# EAGLE design sensorBoard (EAGLE 7.6.0)
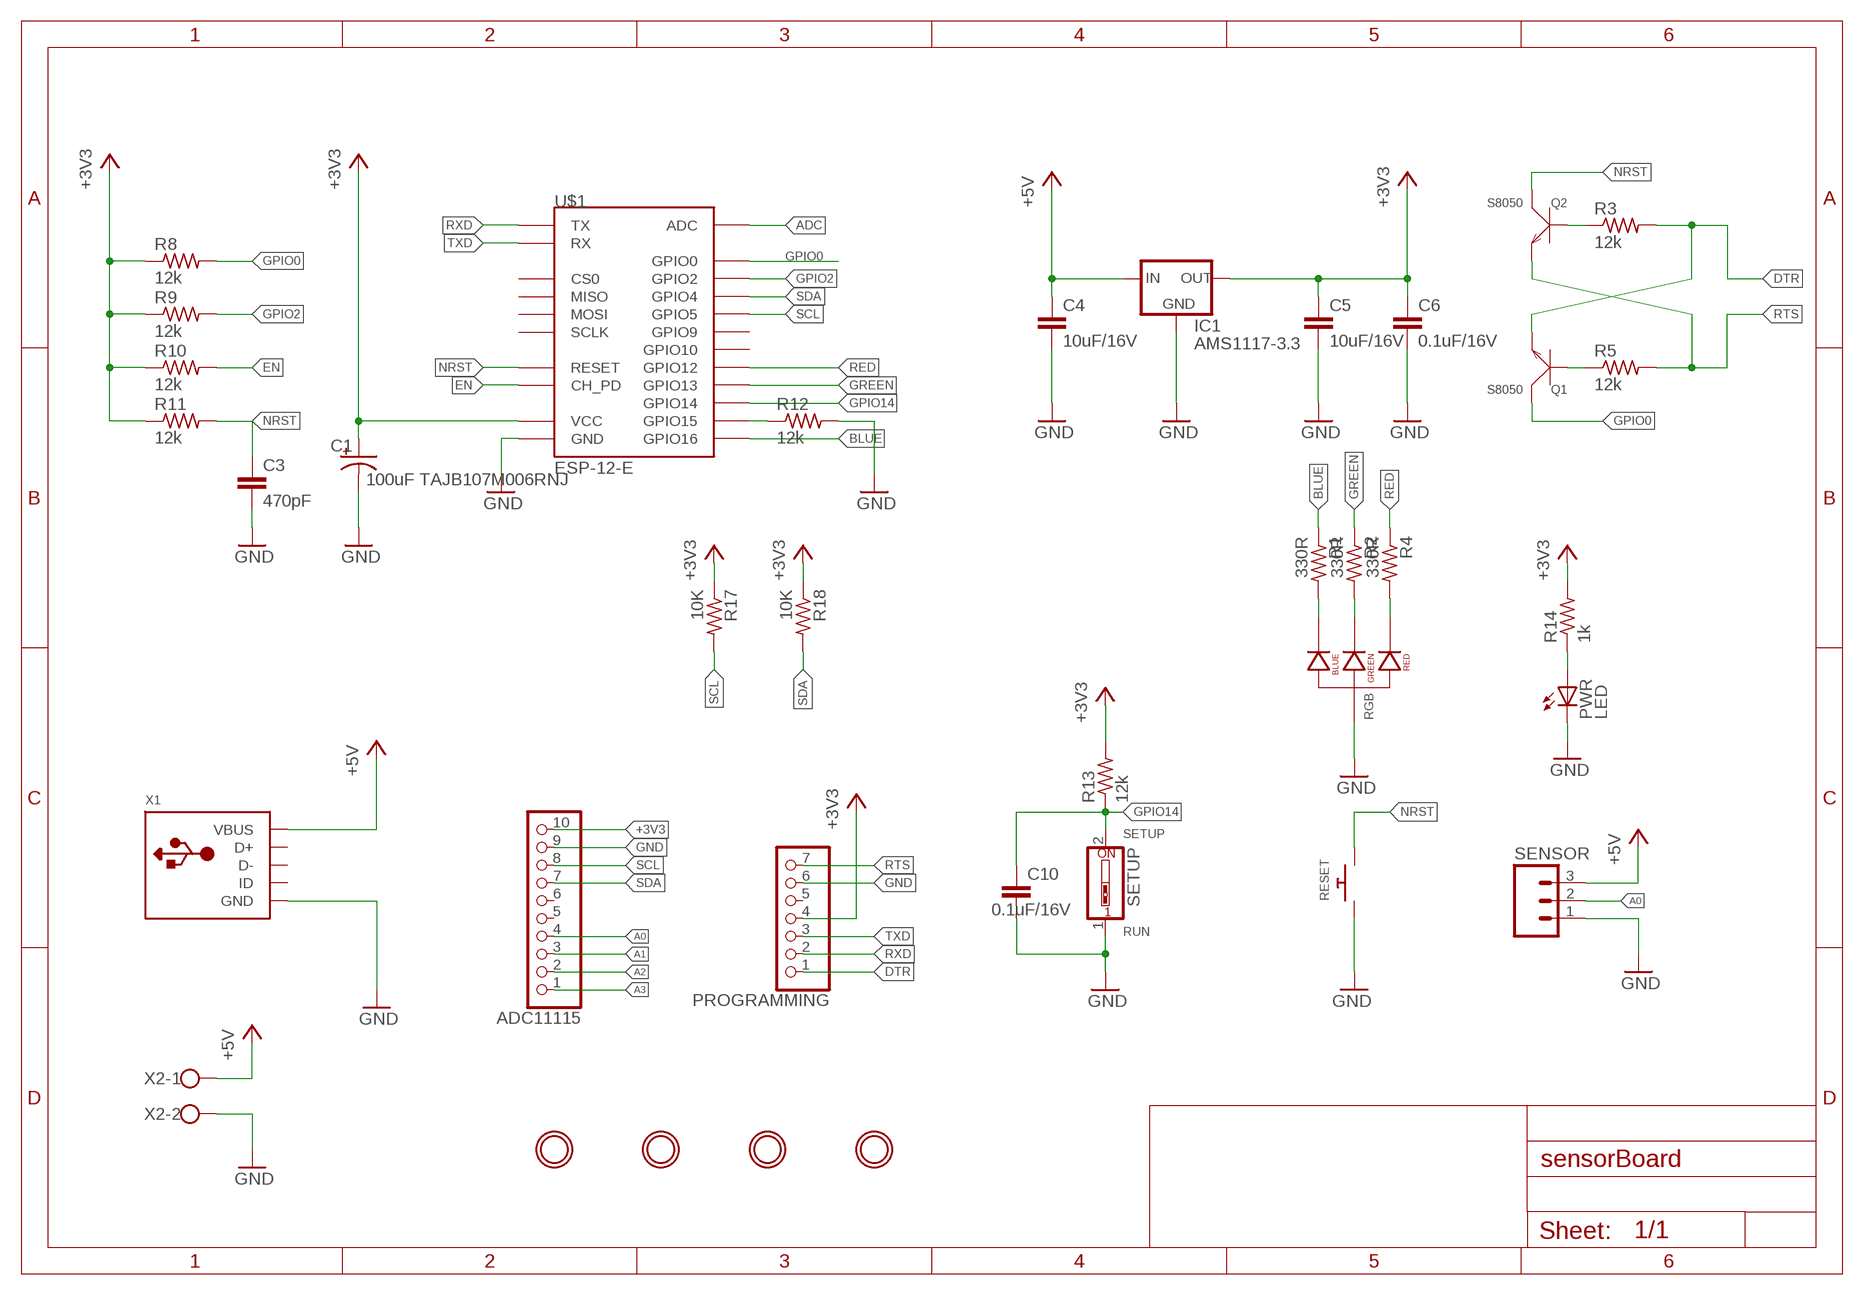
[diagram p0: schematic, sheet 1]

## Parts
ADC11115  PINHD-1X10  [1X10]
C1  100uF TAJB107M006RNJ  CPOL-USA/3216-18R  [A/3216-18R]
C3  470pF  C-EUC0805K  [C0805K]
C4  10uF/16V  C-EUC0805K  [C0805K]
C5  10uF/16V  C-EUC0805K  [C0805K]
C6  0.1uF/16V  C-EUC0805K  [C0805K]
C10  0.1uF/16V  C-EUC0805K  [C0805K]
IC1  AMS1117-3.3  LM1117  [SOT223]
PROGRAMMING  PINHD-1X7  [1X07]
PWR  LED  LEDCHIP-LED0805  [CHIP-LED0805]
Q1  S8050  SMD-TRANSISTORS-NPN-25V-500MW(SOT-23)  [SOT-23]
Q2  S8050  SMD-TRANSISTORS-NPN-25V-500MW(SOT-23)  [SOT-23]
R1  330R  R-US_M0805  [M0805]
R2  330R  R-US_M0805  [M0805]
R3  12k  R-US_M0805  [M0805]
R4  330R  R-US_M0805  [M0805]
R5  12k  R-US_M0805  [M0805]
R8  12k  R-US_M0805  [M0805]
R9  12k  R-US_M0805  [M0805]
R10  12k  R-US_M0805  [M0805]
R11  12k  R-US_M0805  [M0805]
R12  12k  R-US_M0805  [M0805]
R13  12k  R-US_M0805  [M0805]
R14  1k  R-US_M0805  [M0805]
R17  10K  R-US_M0805  [M0805]
R18  10K  R-US_M0805  [M0805]
RESET  SWITCH_PUSHBUTTONEVQ-PE  [TACT_PANA-EVQ]
RGB  LED-RGB-CA-THRUCLEAR  [LED-RGB-THRU]
SENSOR  M03JST-PTH-VERT  [JST-3-PTH-VERT]
SETUP  SW_DIP-1  [EDG-01]
U$1  ESP-12-E  [ESP-12-E]
U$3  MOUNTINGHOLE2.5  [MOUNTINGHOLE_2.5_PLATED]
U$4  MOUNTINGHOLE2.5  [MOUNTINGHOLE_2.5_PLATED]
U$5  MOUNTINGHOLE2.5  [MOUNTINGHOLE_2.5_PLATED]
U$6  MOUNTINGHOLE2.5  [MOUNTINGHOLE_2.5_PLATED]
X1  USB_MICRO_20329_V2  [4UCONN_20329_V2]
X2  W237-102  [W237-102]

## Nets
+3V3: ADC11115.10 C1.+ C5.1 C6.1 IC1.2(OUT) PROGRAMMING.4 R8.1 R9.1 R10.1 R11.1 R13.2 R14.2 R17.1 R18.1 U$1.VCC
+5V: C4.1 IC1.3(IN) SENSOR.3 X1.VBUS X2.1
A0: ADC11115.4 SENSOR.2
A1: ADC11115.3
A2: ADC11115.2
A3: ADC11115.1
ADC: U$1.ADC
BLUE: R1.1 U$1.GPIO16
DTR: PROGRAMMING.1 Q1.2(E) R3.2
EN: R10.2 U$1.CH_PD
GND: ADC11115.9 C1.- C3.2 C4.2 C5.2 C6.2 C10.2 IC1.1(GND) PROGRAMMING.6 PWR.C R12.2 RESET.P$1 RGB.2(ANODE) SENSOR.1 SETUP.1 U$1.GND X1.BASE@1(GND) X1.BASE@2(GND) X1.GND X1.SPRT@1(GND) X1.SPRT@2(GND) X1.SPRT@3(GND) X1.SPRT@4(GND) X2.2
GPIO0: Q1.3(C) R8.2 U$1.GPIO0
GPIO2: R9.2 U$1.GPIO2
GPIO14: C10.1 R13.1 SETUP.2 U$1.GPIO14
GREEN: R2.1 U$1.GPIO13
N$1: Q2.1(B) R3.1
N$2: Q1.1(B) R5.1
N$3: R12.1 U$1.GPIO15
N$8: PWR.A R14.1
N$9: R4.2 RGB.1(RED_CATHODE)
N$10: R2.2 RGB.3(GREEN_CATHODE)
N$11: R1.2 RGB.4(BLUE_CATHODE)
NRST: C3.1 Q2.3(C) R11.2 RESET.P$2 U$1.RESET
RED: R4.1 U$1.GPIO12
RTS: PROGRAMMING.7 Q2.2(E) R5.2
RXD: PROGRAMMING.2 U$1.TX
SCL: ADC11115.8 R17.2 U$1.GPIO5
SDA: ADC11115.7 R18.2 U$1.GPIO4
TXD: PROGRAMMING.3 U$1.RX
Unconnected: ADC11115.5 ADC11115.6 PROGRAMMING.5 U$1.CS0 U$1.GPIO9 U$1.GPIO10 U$1.MISO U$1.MOSI U$1.SCLK X1.D+ X1.D- X1.ID

## Notes on the sheet
- SETUP
- RUN

## Library data of the parts
ADC11115 = pinhead:PINHD-1X10: PIN HEADER
C1 = rcl:CPOL-US: POLARIZED CAPACITOR, American symbol
C3-C6 C10 = rcl:C-EU: CAPACITOR, European symbol
IC1 = v-reg-3:LM1117
PROGRAMMING = pinhead:PINHD-1X7: PIN HEADER
PWR = led:LED: LED OSRAM: - CHIPLED LG R971, LG N971, LY N971, LG Q971, LY Q971, LO R971, LY R971 LH N974, LH R974 LS Q976, LO Q976, LY Q976 LO Q996 - Hyper CHIPLED LW Q18S LB Q993, LB Q99A, LB R99A - SideLED LS A670, LO A670, LY A670, LG A670, LP A670 LB A673, LV A673, LT A673, LW A673 LH A674 LY A675 LS A676, LA A676, LO A676, LY A676, LW A676 LS A679, LY A679, LG A679 - Hyper Micro SIDELED® LS Y876, LA Y876, LO Y876, LY Y876 LT Y87S - SmartLED LW L88C, LW L88S LB L89C, LB L89S, LG L890 LS L89K, LO L89K, LY L89K LS L896, LA L896, LO L896, LY L896 - TOPLED LS T670, LO T670, LY T670, LG T670, LP T670 LSG T670, LSP T670, LSY T670, LOP T670, LYG T670 LG T671, LOG T671, LSG T671 LB T673, LV T673, LT T673, LW T673 LH T674 LS T676, LA T676, LO T676, LY T676, LB T676, LH T676, LSB T676, LW T676 LB T67C, LV T67C, LT T67C, LS T67K, LO T67K, LY T67K, LW E67C LS E67B, LA E67B, LO E67B, LY E67B, LB E67C, LV E67C, LT E67C LW T67C LS T679, LY T679, LG T679 LS T770, LO T770, LY T770, LG T770, LP T770 LB T773, LV T773, LT T773, LW T773 LH T774 LS E675, LA E675, LY E675, LS T675 LS T776, LA T776, LO T776, LY T776, LB T776 LHGB T686 LT T68C, LB T68C - Hyper Mini TOPLED® LB M676 - Mini TOPLED Santana® LG M470 LS M47K, LO M47K, LY M47K Source: http://www.osram.convergy.de LUXEON: - LUMILED® LXK2-PW12-R00, LXK2-PW12-S00, LXK2-PW14-U00, LXK2-PW14-V00 LXK2-PM12-R00, LXK2-PM12-S00, LXK2-PM14-U00 LXK2-PE12-Q00, LXK2-PE12-R00, LXK2-PE12-S00, LXK2-PE14-T00, LXK2-PE14-U00 LXK2-PB12-K00, LXK2-PB12-L00, LXK2-PB12-M00, LXK2-PB14-N00, LXK2-PB14-P00, LXK2-PB14-Q00 LXK2-PR12-L00, LXK2-PR12-M00, LXK2-PR14-Q00, LXK2-PR14-R00 LXK2-PD12-Q00, LXK2-PD12-R00, LXK2-PD12-S00 LXK2-PH12-R00, LXK2-PH12-S00 LXK2-PL12-P00, LXK2-PL12-Q00, LXK2-PL12-R00 Source: www.luxeon.com KINGBRIGHT: KA-3528ASYC Source: www.kingbright.com
Q1 Q2 = s8050-transistor:SMD-TRANSISTORS-NPN-25V-500MW(SOT-23): 305010017; AVAILABILITY: Unavailable; DESCRIPTION: SMD Transistors NPN 25V-500mW%3B; MF: JCET; MP: S8050; PACKAGE: SOT-23-3 JCET; PRICE: None
R1-R5 R8-R14 R17 R18 = rcl:R-US_: RESISTOR, American symbol
RESET = adafruit:SWITCH_PUSHBUTTON: Buttons SOFTTOUCHSMD_SJ - Soft touch temporary push button (Super Junk Akihabara) Compatible with SKPMANE010 [Mouser: 688-SKPMAN] C&K_KSS = Digikey: KSS221GLFS
RGB = SparkFun-LED:LED-RGB-CA-THRU: RGB Through-hole common anode SparkFun store front COM-10821 (diffuse) COM-10820 (clear); PROD_ID: DIO-10631
SENSOR = SparkFun-Connectors:M03: Header 3 Standard 3-pin 0.1" header. Use with straight break away headers (SKU : PRT-00116), right angle break away headers (PRT-00553), swiss pins (PRT-00743), machine pins (PRT-00117), and female headers (PRT-00115). Molex polarized connector foot print use with SKU : PRT-08232 with associated crimp pins and housings.
SETUP = special:SW_DIP-1: DIP SWITCH
U$1 = esp8266modules:ESP-12-E: ESP8266 Wifi Module ESP-12-E; DIMENSIONS: 24.0 x 16.0 mm; PINS: 22; PITCH: 0.078" / 2 mm
U$3-U$6 = Adafruit SIM808 Breakout:MOUNTINGHOLE: Mounting Hole For #2 screws (0.086"/2.18mm width, 0.094"/2.4mm hole) use 2.5mm; BOM: EXCLUDE
X1 = Adafruit SIM808 Breakout:USB: USB Connectors USBMINIB - Surface Mount Female Mini-B USB Connector 4UConnector: 06564
X2 = con-wago-500:W237-102: WAGO SCREW CLAMP; MPN: 237-102; OC_FARNELL: unknown; OC_NEWARK: 70K9898

## Net classes
0 default: width 0.203 mm, drill 0.356 mm, clearance 0.254 mm

## Board
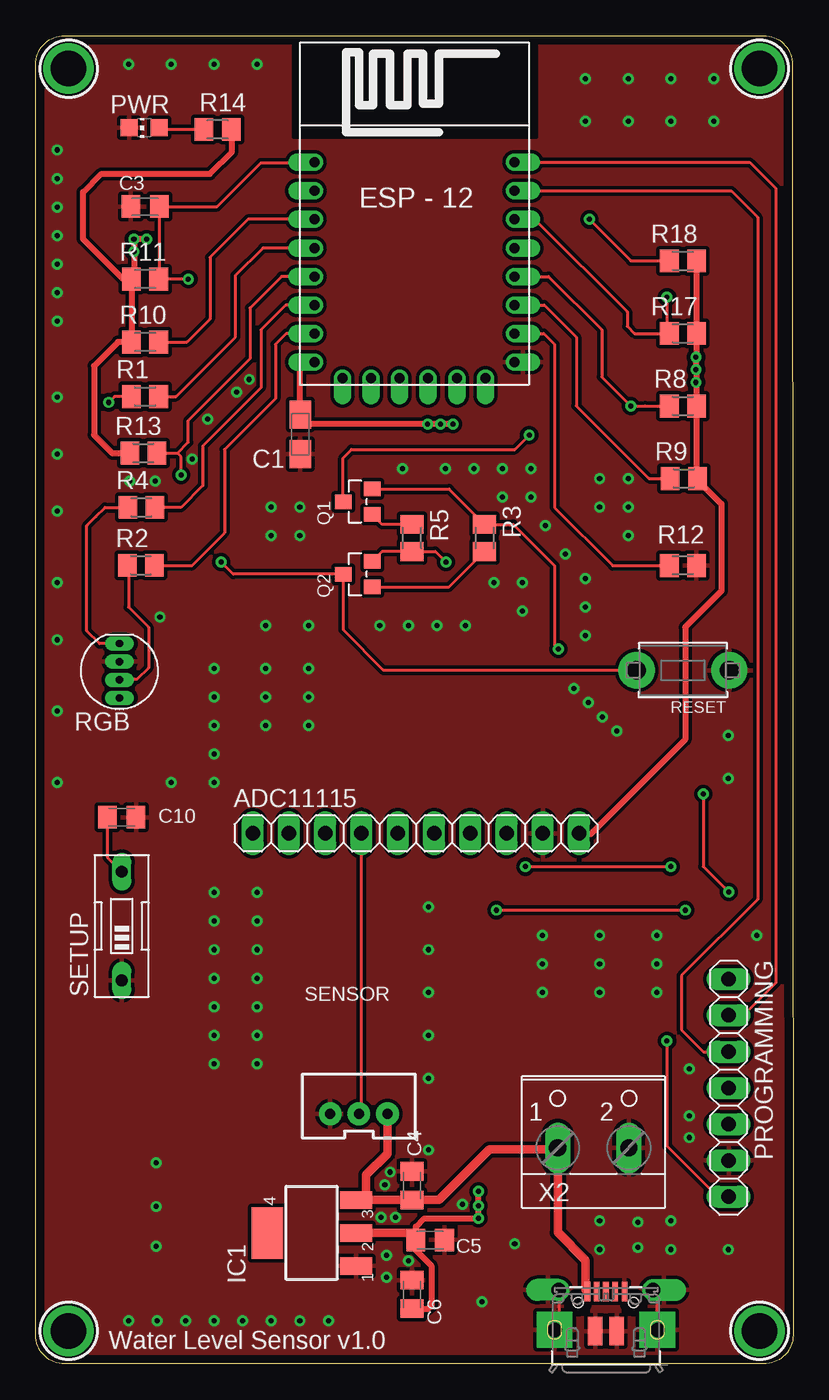
[diagram p1: board, top side]
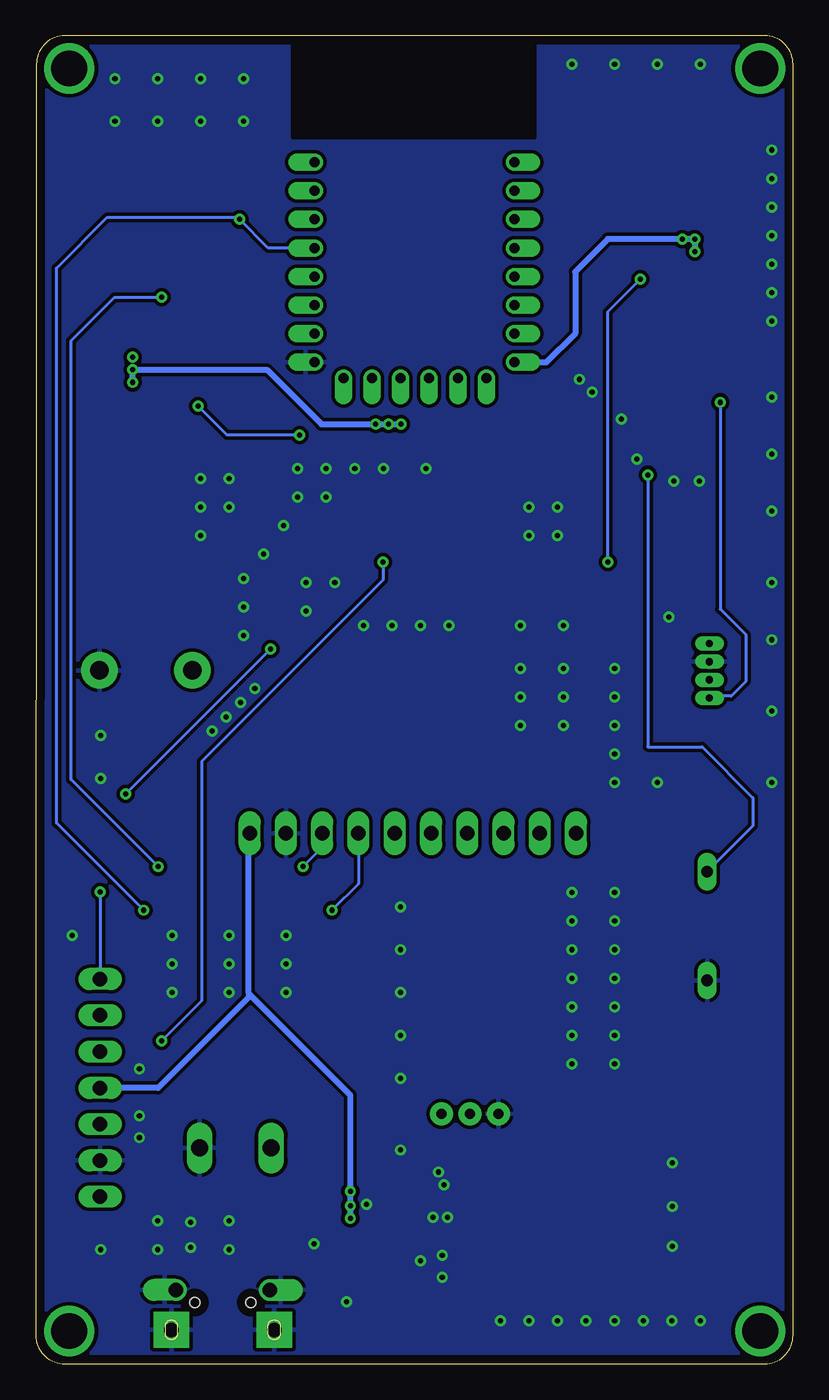
[diagram p2: board, bottom side, seen from below]

Size 53.05 x 93 mm. Coordinates in mm from the lower left corner, seen from the top.
Outline: 0,2 0,91 arc-90 2,93 51,93 arc-90 53,91 53.05,2 arc-90 51,0 2,0 arc-90 0,2
Copper layers (1*16): Top 0.035mm / dielectric 1.5mm / Bottom 0.035mm
Design rules "default *": minimum track width 8mil, minimum drill 14mil, track to track 8mil, track to pad 8mil, pad to pad 8mil, via to via 8mil, smd to smd 8mil, copper to edge 24mil, drill to drill 8mil, minimum pad ring 10mil, minimum via ring 8mil, stop-mask expansion 4mil, vias tented up to drill 0mil, thermal gap 10mil

### Footprints (pad centres in the part's own frame; a part is rotated, then mirrored left to right if it is on the bottom)
1X10 = drill 1.016 long: 1 -11.43,0; 2 -8.89,0; 3 -6.35,0; 4 -3.81,0; 5 -1.27,0; 6 1.27,0; 7 3.81,0; 8 6.35,0; 9 8.89,0; 10 11.43,0
A/3216-18R = smd 1.95 x 1.5: + 1.375,0; - -1.375,0
C0805K = smd 1.3 x 1.6: 1 -1,0; 2 1,0
SOT223 = smd 1.219 x 2.235: 1 -2.311,-3.099; 2 0,-3.099; 3 2.311,-3.099 | smd 3.6 x 2.2: 4 0,3.099
1X07 = drill 1.016 long: 1 -7.62,0; 2 -5.08,0; 3 -2.54,0; 4 0,0; 5 2.54,0; 6 5.08,0; 7 7.62,0
CHIP-LED0805 = smd 1.2 x 1.2: A 0,-1.05; C 0,1.05
SOT-23 = smd 1.016 x 1.143: 1 -0.889,-1.016; 2 0.889,-1.016; 3 0,1.016
M0805 = smd 1.3 x 1.6: 1 -0.95,0; 2 0.95,0
TACT_PANA-EVQ = drill 1.3 pad 2.54: P$1 -3.25,0; P$2 3.25,0
LED-RGB-THRU = drill 0.508 pad 0.762 long: 1 1.905,0; 2 0.635,0; 3 -0.635,0; 4 -1.905,0
JST-3-PTH-VERT = drill 0.7 pad 1.6: 1 -2,-0.55; 2 0,-0.55; 3 2,-0.55
EDG-01 = drill 0.813 long: 1 0,-3.81; 2 0,3.81
ESP-12-E = drill 0.7 offset: ADC -7.1,3.8; CH_PD -7.1,1.8; CS0 -5.14,-9.33; GND 6.9,-8.2; GPIO0 6.9,-2.2; GPIO2 6.9,-4.2; GPIO4 6.9,-0.2; GPIO5 6.9,1.8; GPIO9 -1.14,-9.33; GPIO10 0.86,-9.33; GPIO12 -7.1,-4.2; GPIO13 -7.1,-6.2; GPIO14 -7.1,-2.2; GPIO15 6.9,-6.2; GPIO16 -7.1,-0.2; MISO -3.14,-9.33; MOSI 2.86,-9.33; RESET -7.1,5.8; RX 6.9,3.8; SCLK 4.86,-9.33; TX 6.9,5.8; VCC -7.1,-8.2
MOUNTINGHOLE_2.5_PLATED = drill 2.5 pad 3.2: P$1 0,0
4UCONN_20329_V2 = smd 1 x 2: BASE@1 -0.75,-2; BASE@2 0.75,-2 | smd 0.4 x 1.35: D+ 0,0.775; D- -0.65,0.775; GND 1.3,0.775; ID 0.65,0.775; VBUS -1.3,0.775 | drill 1.016 pad 1.454 offset: SPRT@1 -3.3,0.9; SPRT@2 3.3,0.9 | drill 1.016 pad 2.5 square: SPRT@3 -3.6,-1.9; SPRT@4 3.6,-1.9 | hole 0.7: -1.95,0; 1.95,0
W237-102 = drill 1.194 long: 1 -2.5,-1.27; 2 2.5,-1.27

### Placement (x,y rotation side)
ADC11115  26.63,37.15 0 top
C1  18.53,65.08 90 top
C3  7.66,81.04 180 top
C4  26.36,12.48 90 top
C5  27.63,8.67 0 top
C6  26.36,4.86 90 top
C10  6.02,38.27 0 top
IC1  19.33,9.16 90 top
PROGRAMMING  48.54,19.32 270 top
PWR  7.61,86.55 90 top
Q1  22.55,60.37 90 top
Q2  22.55,55.29 90 top
R1  7.66,67.74 180 top
R2  7.37,55.91 180 top
R3  31.44,57.83 90 top
R4  7.41,59.97 180 top
R5  26.36,57.83 270 top
R8  45.33,67.07 180 top
R9  45.4,61.99 180 top
R10  7.66,71.55 0 top
R11  7.66,75.96 0 top
R12  45.33,55.91 0 top
R13  7.55,63.77 180 top
R14  12.74,86.43 0 top
R17  45.33,72.15 180 top
R18  45.33,77.23 180 top
RESET  45.33,48.56 180 top
RGB  5.87,48.53 90 top
SENSOR  22.63,18.05 0 top
SETUP  6.02,30.65 0 top
U$1  26.63,78.34 0 top
U$3  50.7,2.3 0 top
U$4  50.7,90.7 0 top
U$5  2.3,90.7 0 top
U$6  2.3,2.3 0 top
X1  39.94,4.28 0 top
X2  39.06,16.38 0 top

### Tracks (layer width: path | path; a pad name or v marks a point on that pad's centre or on a via)
+3V3  (via drill 0.36 pad 0.76)
  Top 0.203: 46.28,62.06 R9.1 46.35,61.9 | 13.74,86.38 R14.2 | R17.1 46.28,69.64 v46.25,69.61 | 19.19,65.8 C1.+ | 26.36,8.4 26.36,8.22 | 26.39,3.83 C6.1
  Top 0.406: R18.1 R17.1 46.28,70.47 | 46.28,62.06 R8.1 46.28,69.64 46.28,70.47 | R11.1 R10.1 5.77,71.55 4.09,69.87 4.09,65.04 5.36,63.77 R13.2 | R11.1 6.12,75.96 3.33,78.76 3.33,82.06 4.6,83.33 12.22,83.33 13.74,84.85 13.74,86.38 | C1.+ 18.53,69.83 18.82,70.12 19.51,70.12 U$1.VCC | 26.36,8.4 C5.1 26.63,9.6 27.2,10.18 v31.01,10.18 v31.01,11.06 v31.01,12.08 | 46.35,61.9 48.03,60.21 48.03,54.12 45.49,51.58 45.49,43.7 38.87,37.08 38.12,37.08 ADC11115.10 | 19.19,65.8 v27.46,65.8 v28.34,65.8 v29.23,65.8 | 26.36,8.22 27.71,6.87 27.71,4.08 27.46,3.83 26.39,3.83 | 46.28,70.47 v46.25,70.5 | R11.1 6.88,76.13 v6.88,78.76 v7.77,78.76
  Top 0.61: IC1.2 26.14,9.16 C5.1
  Bottom 0.203: 19.51,70.12 U$1.VCC
  Bottom 0.406: v27.46,65.8 33.04,65.8 36.85,69.61 v46.25,69.61 v46.25,68.72 | 19.51,70.12 17.3,70.12 15.26,72.15 15.26,76.47 12.98,78.76 v6.88,78.76 v6.88,77.87 | 38.12,25.92 38.12,25.67 44.47,19.32 PROGRAMMING.4 | v31.01,10.18 31.01,18.81 38.12,25.92 | 38.12,25.92 38.12,37.08 ADC11115.10
+5V
  Top 0.203: 22.18,11.48 23.14,11.48 23.39,11.48 23.14,11.73 | X1.VBUS 38.51,5.2
  Top 0.406: IC1.3 23.13,11.47 23.14,11.48
  Top 0.61: 23.39,11.48 C4.1 28.25,11.48 31.77,15 36.45,15 X2.1 36.56,9.2 38.51,7.26 38.51,5.2 | SENSOR.3 24.63,14.72 23.14,13.22 23.14,11.73
A0
  Top 0.203: ADC11115.4 22.79,38.64 22.79,17.66 SENSOR.2
BLUE
  Top 0.203: R1.1 9.84,67.74 13.99,71.9 13.99,76.22 15.92,78.14 U$1.GPIO16
DTR  (via drill 0.36 pad 0.76)
  Top 0.203: Q1.2 28.96,61.26 R3.2 33.46,58.78 36.35,55.9 36.35,50.31 v36.6,50.05 | v46.76,39.89 46.76,34.81 v48.54,33.04
  Bottom 0.203: v36.6,50.05 v46.76,39.89 | v48.54,33.04 PROGRAMMING.1
EN
  Top 0.203: U$1.CH_PD 14.87,80.14 12.22,77.49 12.22,73.17 10.6,71.55 R10.2
GND  (via drill 0.36 pad 0.76)
  Top 0.203: X1.SPRT@1 36.64,2.68 X1.SPRT@3 | X1.SPRT@4 43.54,4.88 X1.SPRT@2
  other vias: 33.55,8.4 31.27,4.33 39.5,8 39.5,10 42.19,9.92 42.19,8.14 44.5,10 44.5,8 48.5,8 38.5,90 38.5,87 41.5,87 44.5,87 47.5,87 47.5,90 44.5,90 41.5,90 6.5,91 9.5,91 12.5,91 15.5,91 1.5,85 1.5,83 1.5,81 1.5,79 1.5,77 1.5,75 1.5,73 39.5,30 39.5,28 39.5,26 43.5,30 43.5,28 43.5,26 35.5,30 35.5,28 35.5,26 27.5,32 27.5,29 27.5,26 27.5,23 27.5,20 27.5,14.97 12.5,33 12.5,31 12.5,29 12.5,27 12.5,25 12.5,23 12.5,21 15.5,21 15.5,23 15.5,25 15.5,27 15.5,29 15.5,31 15.5,33 6.5,3 8.5,3 10.5,3 12.5,3 14.5,3 16.5,3 18.5,3 20.5,3 50.5,30 48.5,44 48.5,41 39.5,62 39.5,60 41.5,58 41.5,60 41.5,62 38.5,55 38.5,53 38.5,51 16.5,60 16.5,58 18.5,58 18.5,60 25.7,62.7 28.7,62.7 30.7,62.7 32.7,62.7 34.7,62.7 34.7,60.7 32.7,60.7 35.7,58.7 37.1,56.7 34.1,54.7 34.1,52.7 32.1,54.7 24.1,51.7 26.1,51.7 28.1,51.7 30.1,51.7 16.1,51.7 16.1,48.7 16.1,46.7 16.1,44.7 19.1,48.7 19.1,46.7 19.1,44.7 19.1,51.7 37.7,47.3 38.7,46.3 39.7,45.3 40.7,44.3 8.7,52.3 1.5,67.7 1.5,63.7 1.5,59.7 1.5,54.7 1.5,50.7 1.5,45.7 1.5,40.7 9.5,40.7 12.5,40.7 12.5,42.7 12.5,44.7 12.5,46.7 12.5,48.7 45.79,15.84 45.79,17.36 45.79,20.67 8.45,14.06 8.45,11.01 8.45,8.22 24.2,10.25 29.89,11.17 25.21,10.25 24.58,7.59 24.58,6.06 26.1,7.2 24.45,12.54 24.83,13.43 14.96,68.94 14.07,68.05 12.04,66.14 10.95,63.35 8.36,61.82 6.58,61.82
  pour Top: -0.74,93.23 -0.74,-0.49 53.87,-0.49 53.87,93.49 -0.74,93.49
  pour Bottom: -0.74,93.49 53.87,93.49 53.87,-0.49 -0.74,-0.49
GPIO0  (via drill 0.36 pad 0.76)
  Top 0.203: U$1.GPIO0 35.91,76.14 39.65,72.41 39.65,69.1 v41.68,67.07 42.7,67.07 R8.2 | Q1.3 21.53,63.44 22.12,64.02 33.55,64.02 v34.57,65.04
  Bottom 0.203: v34.57,65.04 39.65,65.04 v41.68,67.07
GPIO2
  Top 0.203: U$1.GPIO2 35.63,74.14 37.87,71.9 37.87,67.07 42.95,61.99 R9.2
GPIO14  (via drill 0.36 pad 0.76)
  Top 0.203: U$1.GPIO14 17.22,76.14 15.01,73.93 15.01,70.37 10.69,66.06 10.69,64.53 9.93,63.77 | 9.93,63.77 R13.1 8.66,63.77 | C10.1 5.02,35.46 SETUP.2 | v10.18,62.25 10.18,63.52 9.93,63.77
  Bottom 0.203: v10.18,62.25 10.18,43.2 6.37,43.2 2.82,39.64 2.82,37.67 SETUP.2
GREEN
  Top 0.203: U$1.GPIO13 17.54,72.14 16.79,71.39 16.79,67.58 13.23,64.02 13.23,58.18 10.96,55.91 R2.1
N$1
  Top 0.203: Q2.1 28.96,54.4 R3.1
N$2
  Top 0.203: R5.1 24.27,58.78 Q1.1
N$3
  Top 0.203: U$1.GPIO15 35.6,72.14 36.35,71.39 36.35,59.96 40.41,55.9 44.37,55.9 R12.1
N$4
  cutout Bottom: 18.06,92.98 35.08,92.98 35.08,86.12 35.08,85.87 18.06,85.87
N$5
  cutout Top: 18.06,92.98 35.08,92.98 35.08,85.87 18.06,85.87
N$8
  Top 0.203: R14.1 8.77,86.43 PWR.A
N$9
  Top 0.203: R4.2 6.44,59.96 4.85,59.96 4.21,59.33 3.83,58.94 3.58,58.69 3.58,51.32 4.47,50.44 RGB.1
N$10
  Top 0.203: R2.2 6.5,55.84 6.5,52.98 7.9,51.58 7.9,48.73 7.09,47.92 5.89,47.92 RGB.3
N$11  (via drill 0.36 pad 0.76)
  Top 0.203: R1.2 5.52,67.74 v5.1,67.33
  Bottom 0.203: v5.1,67.33 5.1,52.85 3.33,51.07 3.33,47.77 4.34,46.75 5.74,46.75 RGB.4
NRST  (via drill 0.36 pad 0.76)
  Top 0.203: U$1.RESET 19.48,84.09 15.77,84.09 12.72,81.04 C3.1 8.66,76.01 R11.2 v10.69,75.96 | RESET.P$2 24.38,48.56 21.53,51.4 Q2.3 13.84,55.29 v12.98,56.15
  Bottom 0.203: v12.98,56.15 12.98,73.68 v10.69,75.96
RED
  Top 0.203: U$1.GPIO12 17.51,74.14 15.77,72.41 15.77,68.34 11.71,64.28 11.71,61.48 10.18,59.96 R4.1
RTS  (via drill 0.36 pad 0.76)
  Top 0.203: Q2.2 24.27,56.88 R5.2 28,56.88 v28.73,56.15 | v44.22,22.62 44.22,15.26 47.78,11.7 PROGRAMMING.7
  Bottom 0.203: v28.73,56.15 28.73,54.88 41.43,42.18 41.43,25.42 v44.22,22.62
RXD
  Top 0.203: PROGRAMMING.2 49.55,24.4 51.84,26.69 51.84,82.31 50.01,84.14 U$1.TX
SCL  (via drill 0.36 pad 0.76)
  Top 0.203: v44.22,74.69 44.22,72.31 R17.2 41.93,72.15 41.43,72.66 41.43,73.68 35.08,80.03 33.64,80.03 U$1.GPIO5 | v34.31,34.81 v44.47,34.81
  Bottom 0.203: ADC11115.8 32.98,36.15 v34.31,34.81 | v44.47,34.81 50.57,40.91 50.57,71.64 47.52,74.69 v44.22,74.69
SDA  (via drill 0.36 pad 0.76)
  Top 0.203: v38.77,80.14 41.68,77.23 R18.2 | v32.28,31.77 v45.49,31.77
  Bottom 0.203: ADC11115.7 30.44,33.61 v32.28,31.77 | v45.49,31.77 51.59,37.86 51.59,76.72 48.03,80.28 38.91,80.28 v38.77,80.14 36.77,78.14 U$1.GPIO4
TXD
  Top 0.203: U$1.RX 48.71,82.14 50.57,80.28 50.57,32.53 45.24,27.19 45.24,23.38 46.76,21.86 PROGRAMMING.3

### Text on the board
tNames: SENSOR | Water Level Sensor v1.0